# EAGLE design Stir Plate (EAGLE 6.4)
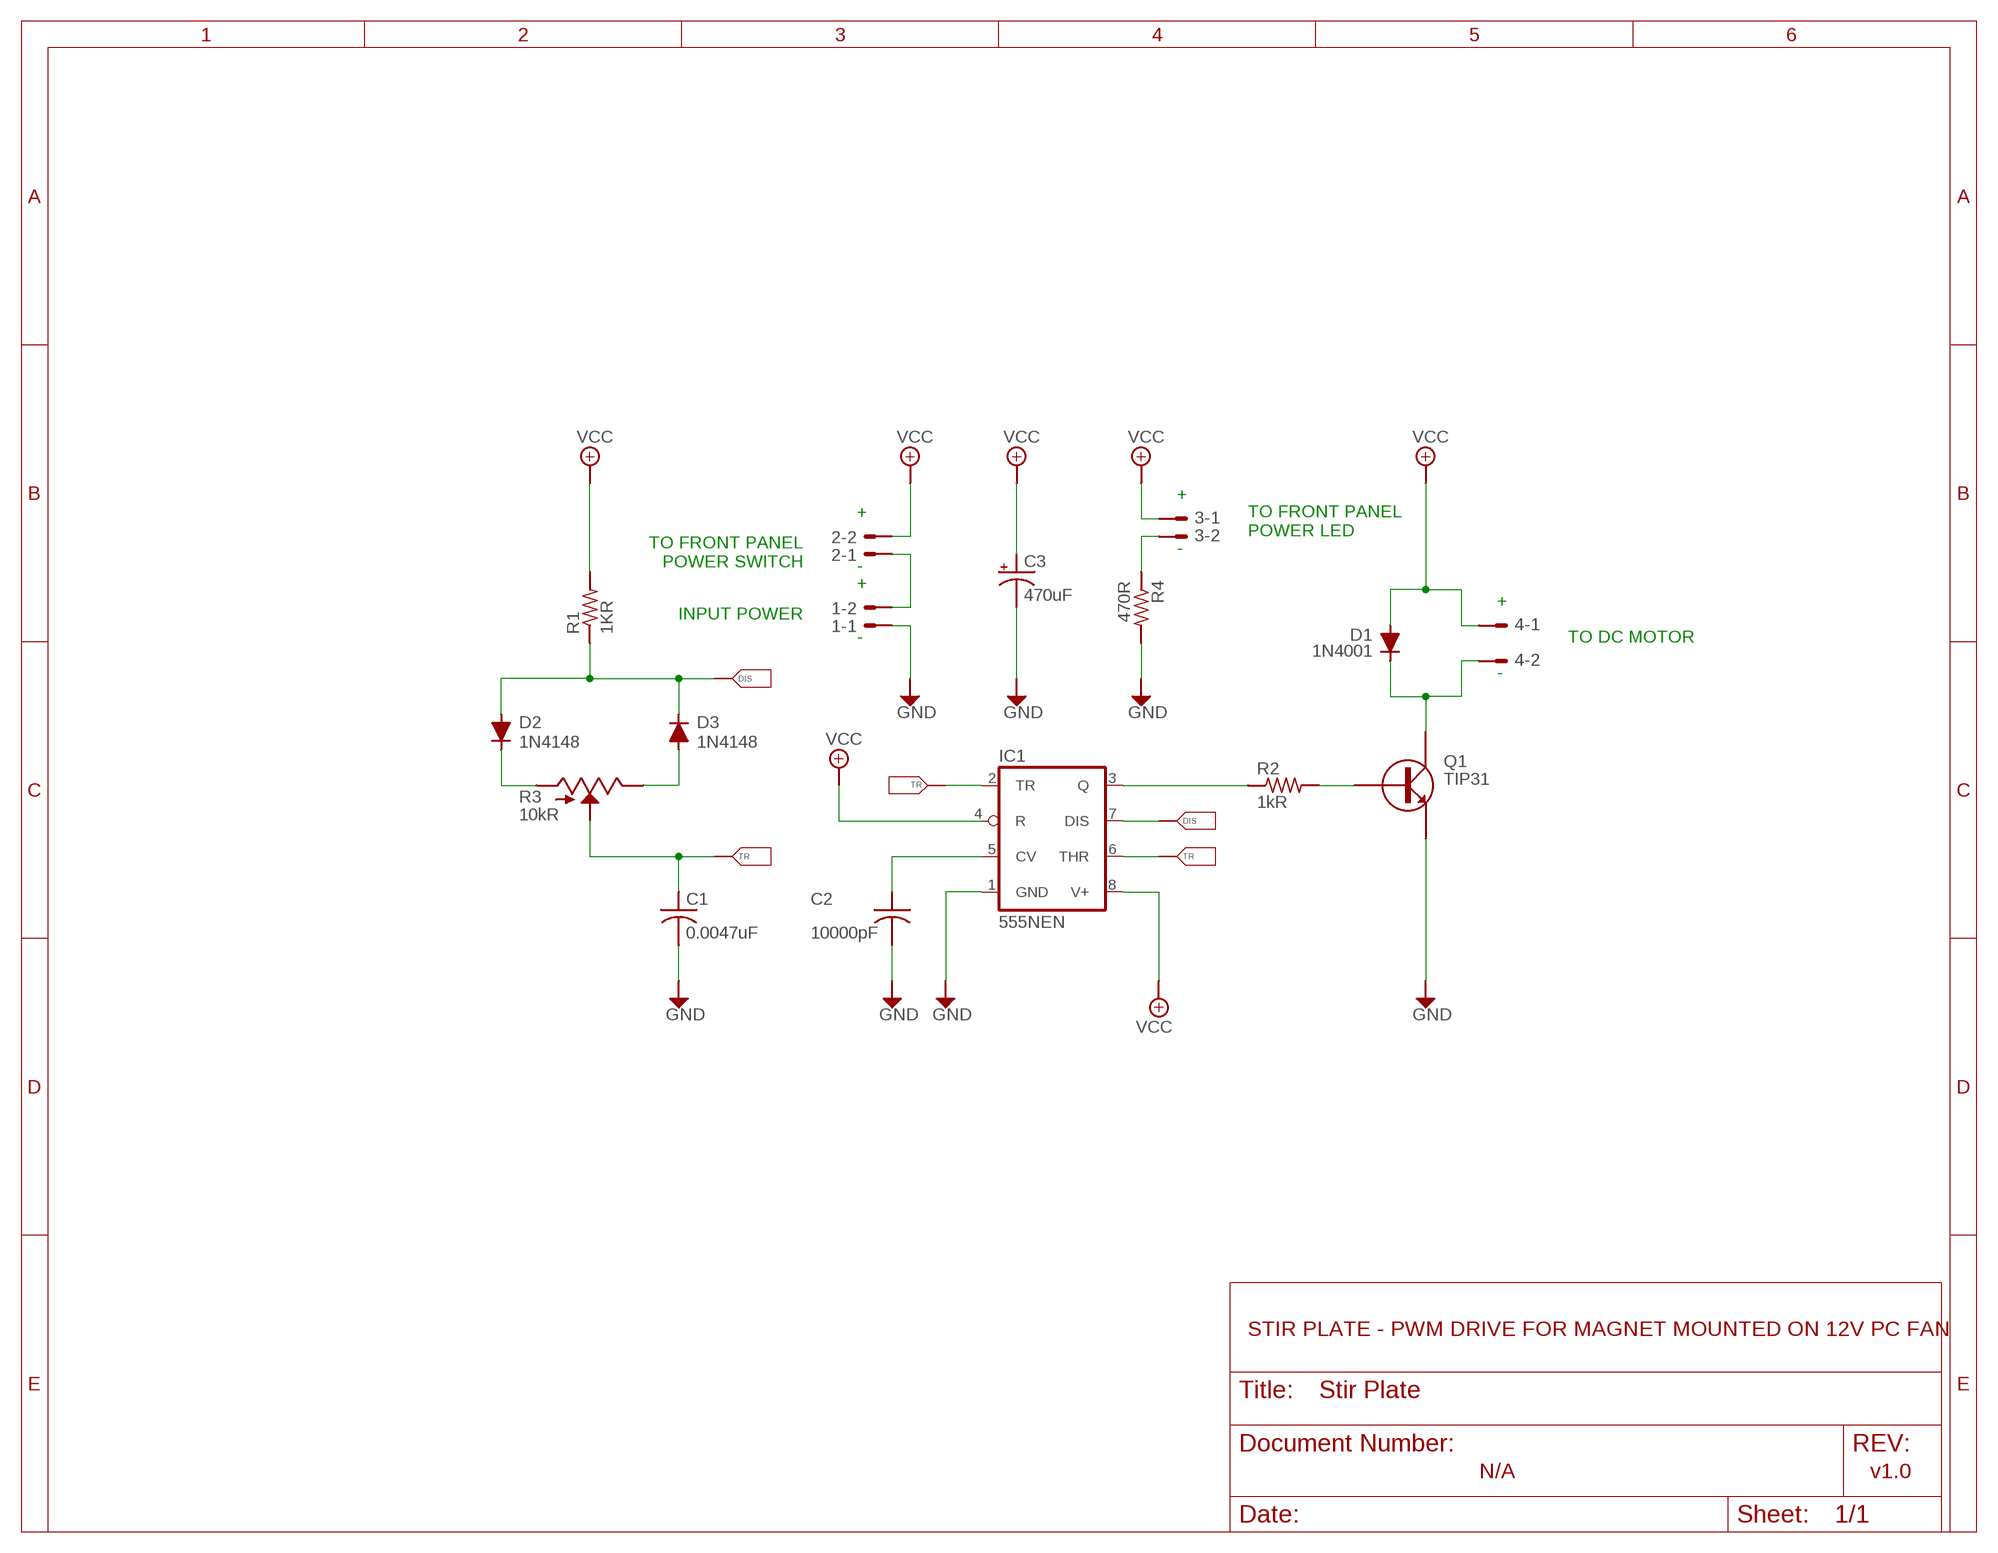
[diagram p0: schematic, sheet 1]

## Parts
1  22-23-2021  [22-23-2021]
2  22-23-2021  [22-23-2021]
3  22-23-2021  [22-23-2021]
4  22-23-2021  [22-23-2021]
C1  0.0047uF  C-US025-030X050  [C025-030X050]
C2  10000pF  C-US025-030X050  [C025-030X050]
C3  470uF  CPOL-USE2-5  [E2-5]
D1  1N4001  [DO41-10]
D2  1N4148  1N4148DO35-7  [DO35-7]
D3  1N4148  1N4148DO35-7  [DO35-7]
FRAME1  FRAME_A_L  [FRAME_A_L]
IC1  555NEN  [DIL08]
Q1  TIP31  [TO220AV]
R1  1KR  R-US_0207/10  [0207/10]
R2  1kR  R-US_0207/10  [0207/10]
R3  10kR  TRIM_US-  [3RP/1610N]
R4  470R  R-US_0207/10  [0207/10]
U$1  DOCFIELD  [DOCFIELD]

## Nets
+12V: 2.2 3.1 4.1 C3.+ D1.A IC1.4(R) IC1.8(V+) R1.2 ; supply symbol labelled VCC
GND: 1.1 C1.2 C2.2 C3.- IC1.1(GND) Q1.E R4.2
N$1: 1.2 2.1
N$2: 4.2 D1.C Q1.C
N$3: D2.A D3.C IC1.7(DIS) R1.1
N$4: D3.A R3.2(E)
N$5: D2.C R3.1(A)
N$6: IC1.2(TR) IC1.6(THR)
N$7: C2.1 IC1.5(CV)
N$8: IC1.3(Q) R2.1
N$9: Q1.B R2.2
N$10: C1.1 R3.3(S)
N$11: 3.2 R4.1

## Notes on the sheet
- +
- +
- TO FRONT PANEL
  POWER SWITCH
- TO FRONT PANEL
  POWER LED
- -
- -
- +
- INPUT POWER | +
- - | TO DC MOTOR
- -
- STIR PLATE - PWM DRIVE FOR MAGNET MOUNTED ON 12V PC FAN
- N/A | v1.0

## Library data of the parts
1-4 = Stir Plate:22-23-2021: .100" (2.54mm) Center Header - 2 Pin; DIGIKEY: WM4200-ND; MF: MOLEX; MPN: 22-23-2021
C1 C2 = Stir Plate:C-US: CAPACITOR, American symbol
C3 = Stir Plate:CPOL-US: POLARIZED CAPACITOR, American symbol
D1 = Stir Plate:1N4001: DIODE general purpose rectifier, 1 A
D2 D3 = Stir Plate:1N4148: DIODE high speed (Philips)
FRAME1 = Stir Plate:FRAME_A_L: FRAME A Size , 8 1/2 x 11 INCH, Landscape
IC1 = Stir Plate:555: TIMER
Q1 = Stir Plate:TIP31: NPN TRANSISTOR
R1 R2 R4 = Stir Plate:R-US_: RESISTOR, American symbol
R3 = Stir Plate:TRIM_US-: POTENTIOMETER
U$1 = Stir Plate:DOCFIELD

## Board
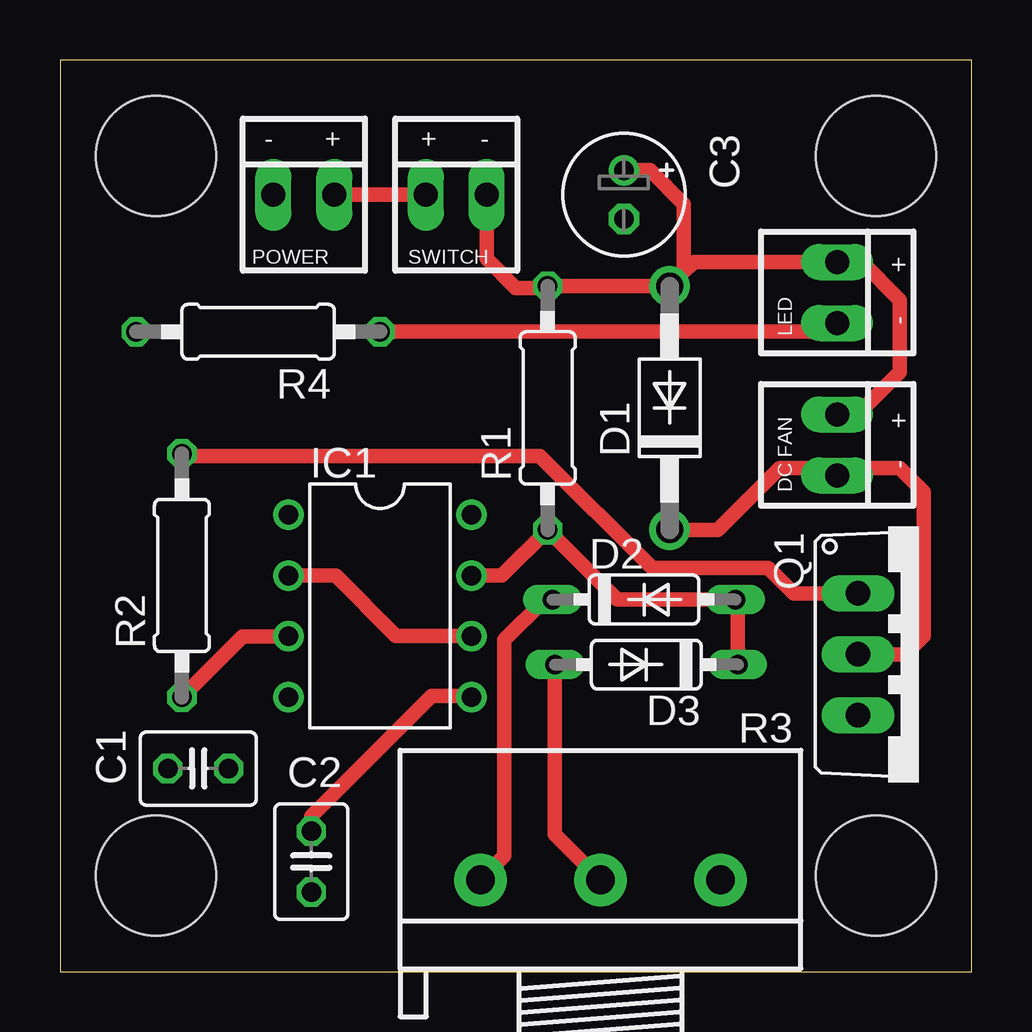
[diagram p1: board, top side]
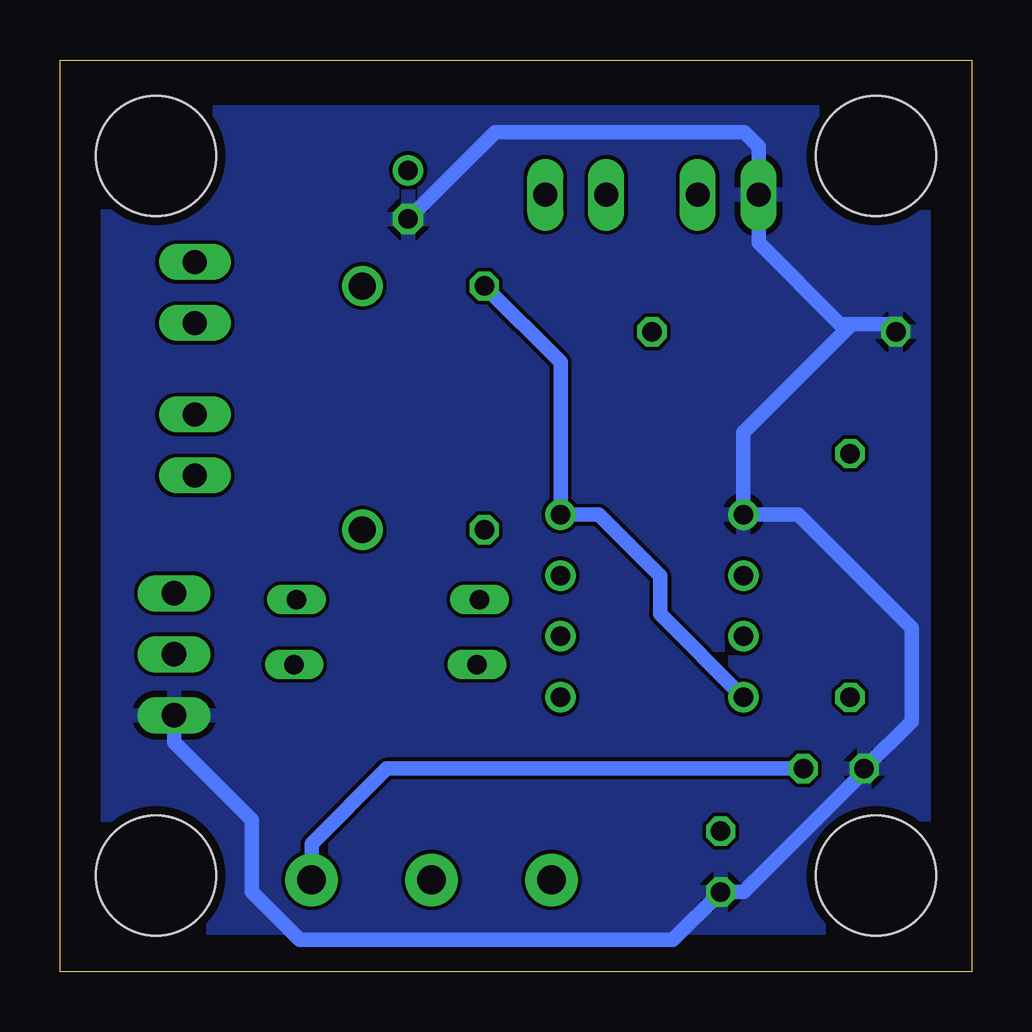
[diagram p2: board, bottom side, seen from below]

Size 38 x 38 mm. Coordinates in mm from the lower left corner, seen from the top.
Outline: 0,0 38,0 38,38 0,38 0,0
Copper layers (1*16): Top 0.0356mm / dielectric 1.5011mm / Bottom 0.0356mm
Design rules "LaenPCBOrder": minimum track width 6mil, minimum drill 13mil, track to track 6mil, track to pad 6mil, pad to pad 6mil, via to via 6mil, smd to smd 6mil, copper to edge 15mil, drill to drill 6mil, minimum pad ring 7mil, minimum via ring 7mil, stop-mask expansion 3mil, vias tented up to drill 0mil, thermal gap 10mil
Holes 5 mm at 4,4 4,34 34,34 34,4

### Footprints (pad centres in the part's own frame; a part is rotated, then mirrored left to right if it is on the bottom)
22-23-2021 = drill 1 long: 1 -1.27,0; 2 1.27,0
C025-030X050 = drill 0.813 octagon: 1 -1.27,0; 2 1.27,0
E2-5 = drill 0.813 pad 1.27: + -1.016,0 | drill 0.813 pad 1.27 octagon: - 1.016,0
DO41-10 = drill 1.118: A 5.08,0; C -5.08,0
DO35-7 = drill 0.813 long: A 3.81,0; C -3.81,0
DIL08 = drill 0.813 pad 1.27: 1 -3.81,-3.81; 2 -1.27,-3.81; 3 1.27,-3.81; 4 3.81,-3.81; 5 3.81,3.81; 6 1.27,3.81; 7 -1.27,3.81; 8 -3.81,3.81
TO220AV = drill 1.016 long: B -2.54,-2.54; C 0,-2.54; E 2.54,-2.54
0207/10 = drill 0.813 octagon: 1 -5.08,0; 2 5.08,0
3RP/1610N = drill 1.2 pad 2.184: 1 -5,0; 2 0,0; 3 5,0

### Placement (x,y rotation side)
1  10.16,32.38 0 top
2  16.51,32.38 0 top
3  32.39,28.3 270 top
4  32.39,21.95 270 top
C1  5.76,8.46 180 top
C2  10.47,4.58 270 top
C3  23.49,32.38 270 top
D1  25.4,23.49 90 top
D2  24.33,15.51 0 top
D3  24.43,12.79 180 top
FRAME1  -122.48,-86.18 0 top  (outside the outline)
IC1  13.33,15.24 270 top
Q1  35.78,13.22 270 top
R1  20.32,23.49 90 top
R2  5.08,16.51 90 top
R3  22.52,3.82 0 top
R4  8.26,26.67 180 top
U$1  49.74,-86.21 0 top  (outside the outline)

### Tracks (layer width: path | path; a pad name or v marks a point on that pad's centre or on a via)
+12V
  Top 0.61: 25.91,29.09 D1.A R1.2 20.24,28.5 19,28.5 17.78,29.72 2.2 | 25.91,29.09 26.4,29.57 3.1 33.42,29.57 35,28 35,25 33.23,23.22 4.1 | C3.+ 24.6,33.4 26,32 26,29.17 25.91,29.09
  Bottom 0.61: IC1.4 13,14.9 13,16.5 15.55,19.05 IC1.8 17.14,25.4 R1.2
GND
  Bottom 0.61: C3.- 19.86,35 9.5,35 8.89,34.39 1.1 8.89,30.39 5.5,27 5,27 | 5,27 3.5,27 R4.2 | 5,27 9.52,22.47 IC1.1 7.25,19.05 2.52,14.32 2.52,10.43 C1.2 4.49,8.35 9.52,3.32 C2.2 12.46,1.32 28.02,1.32 30.02,3.32 30.02,6.32 33.24,9.54 Q1.E
  pour Bottom: 2.02,35.82 36.02,35.82 36.02,1.82 2.02,1.82
N$1
  Top 0.61: 1.2 2.1
N$2
  Top 0.61: Q1.C 35.23,13.22 36,14 36,20 35,21 32.7,21 4.2 32.07,21 30,21 27.42,18.41 D1.C
N$3
  Top 0.61: IC1.7 18.42,16.51 R1.1 23.23,15.51 D2.A 28.24,15.41 D3.C
N$4
  Top 0.61: D3.A 20.62,5.72 R3.2
N$5
  Top 0.61: D2.C 20.21,15.51 18.52,13.82 18.52,4.82 R3.1
N$6
  Top 0.61: IC1.2 11.49,16.51 14,14 17.11,14 IC1.6
N$7
  Top 0.61: IC1.5 17.08,11.5 15.5,11.5 13.97,9.97 10.47,6.47 C2.1
N$8
  Top 0.61: R2.1 7.62,13.97 IC1.3
N$9
  Top 0.61: R2.2 5.17,21.5 20,21.5 24.68,16.82 29.52,16.82 30.58,15.76 Q1.B
N$10
  Bottom 0.61: C1.1 24.38,8.46 27.52,5.32 R3.3
N$11
  Top 0.61: R4.1 32.02,26.67 3.2

### Text on the board
tPlace: POWER | SWITCH | LED | DC FAN
tNames: - | + | + | - | + | - | + | -
Document: STIR PLATE - PWM DRIVE FOR MAGNET MOUNTED ON 12V PC FAN | N/A | v1.0 | 1/1